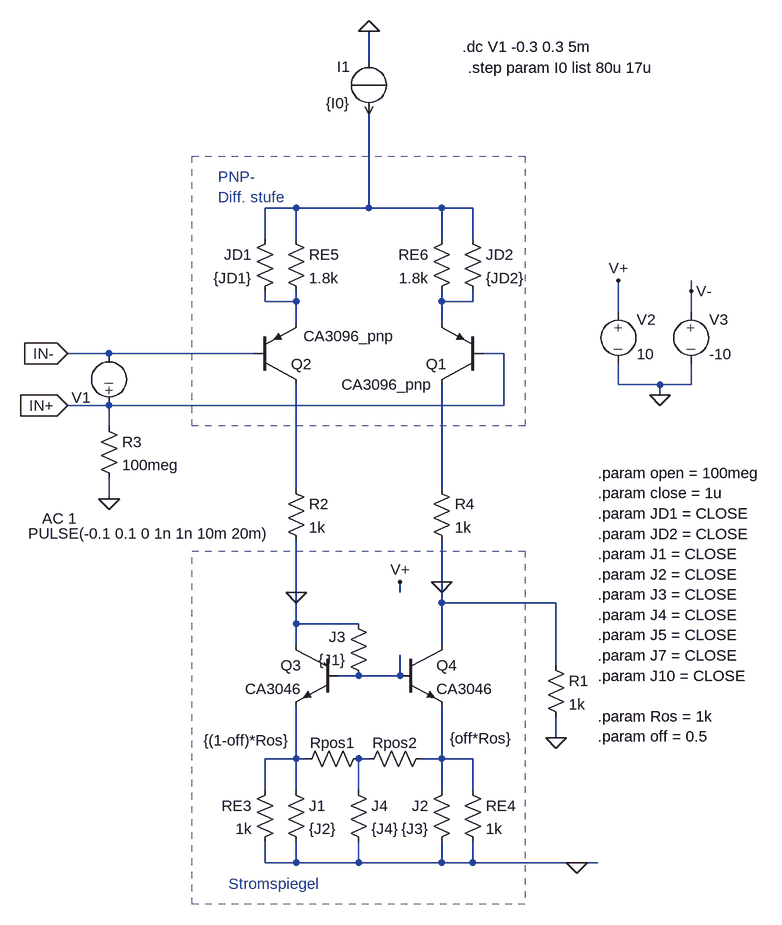
[diagram p0: schematic 2.7.1.4.asc]
2.7.1.4.asc, the LTspice schematic file:
Version 4
SHEET 1 940 1012
WIRE 304 -288 304 -336
WIRE 192 -64 144 -64
WIRE 304 -64 304 -208
WIRE 304 -64 192 -64
WIRE 416 -64 304 -64
WIRE 464 -64 416 -64
WIRE 144 -16 144 -64
WIRE 192 -16 192 -64
WIRE 416 -16 416 -64
WIRE 464 -16 464 -64
WIRE 800 64 800 48
WIRE 144 80 144 64
WIRE 192 80 192 64
WIRE 192 80 144 80
WIRE 416 80 416 64
WIRE 464 80 464 64
WIRE 464 80 416 80
WIRE 688 96 688 48
WIRE 800 96 800 64
WIRE 192 112 192 80
WIRE 416 112 416 80
WIRE -96 160 -160 160
WIRE 128 160 -96 160
WIRE 512 160 480 160
WIRE 688 208 688 176
WIRE 752 208 688 208
WIRE 800 208 800 176
WIRE 800 208 752 208
WIRE 752 224 752 208
WIRE -96 240 -160 240
WIRE 512 240 512 160
WIRE 512 240 -96 240
WIRE -96 272 -96 240
WIRE 192 368 192 208
WIRE 416 368 416 208
WIRE -96 384 -96 352
WIRE 416 512 416 448
WIRE 192 528 192 448
WIRE 352 528 352 512
WIRE 416 544 416 512
WIRE 592 544 416 544
WIRE 192 576 192 528
WIRE 288 576 192 576
WIRE 192 608 192 576
WIRE 416 608 416 544
WIRE 592 640 592 544
WIRE 288 656 256 656
WIRE 352 656 352 624
WIRE 352 656 288 656
WIRE 592 752 592 720
WIRE 192 784 192 704
WIRE 192 784 144 784
WIRE 208 784 192 784
WIRE 304 784 288 784
WIRE 416 784 416 704
WIRE 416 784 384 784
WIRE 464 784 416 784
WIRE 144 832 144 784
WIRE 192 832 192 784
WIRE 288 832 288 784
WIRE 416 832 416 784
WIRE 464 832 464 784
WIRE 144 944 144 912
WIRE 192 944 192 912
WIRE 192 944 144 944
WIRE 288 944 288 912
WIRE 288 944 192 944
WIRE 416 944 416 912
WIRE 416 944 288 944
WIRE 464 944 464 912
WIRE 464 944 416 944
WIRE 624 944 464 944
WIRE 656 944 624 944
FLAG -160 240 IN+
IOPIN -160 240 In
FLAG -160 160 IN-
IOPIN -160 160 In
FLAG -96 384 0
FLAG 752 224 0
FLAG 688 48 V+
FLAG 800 64 V-
FLAG 352 512 V+
FLAG 624 944 0
FLAG 304 -336 0
FLAG 592 752 0
FLAG 192 528 0
FLAG 416 512 0
SYMBOL EIT_Semiconductors\\pnp 480 208 R180
WINDOW 3 77 0 Left 0
SYMATTR Value CA3096_pnp
SYMATTR InstName Q1
SYMBOL EIT_Semiconductors\\pnp 128 208 M180
WINDOW 3 75 75 Left 0
SYMATTR Value CA3096_pnp
SYMATTR InstName Q2
SYMBOL source-V -96 256 R180
WINDOW 123 50 -158 Left 0
WINDOW 39 0 0 Left 0
WINDOW 3 -248 -181 Left 0
SYMATTR Value2 AC 1
SYMATTR InstName V1
SYMATTR Value PULSE(-0.1 0.1 0 1n 1n 10m 20m)
SYMBOL source-I 304 -208 R180
WINDOW 0 29 73 Left 0
WINDOW 3 29 17 Left 0
WINDOW 123 0 0 Left 0
WINDOW 39 0 0 Left 0
SYMATTR InstName I1
SYMATTR Value {I0}
SYMBOL res -112 256 R0
SYMATTR InstName R3
SYMATTR Value 100meg
SYMBOL EIT_Semiconductors\\npn 256 608 M0
SYMATTR InstName Q3
SYMATTR Value CA3046
SYMBOL EIT_Semiconductors\\npn 352 608 R0
SYMATTR InstName Q4
SYMATTR Value CA3046
SYMBOL res 304 768 R90
WINDOW 0 7 56 VBottom 0
WINDOW 3 -28 188 VTop 0
SYMATTR InstName Rpos1
SYMATTR Value {(1-off)*Ros}
SYMBOL res 176 816 R0
SYMATTR InstName J1
SYMATTR Value {J2}
SYMBOL res 432 816 M0
SYMATTR InstName J2
SYMATTR Value {J3}
SYMBOL res 160 816 M0
SYMATTR InstName RE3
SYMATTR Value 1k
SYMBOL res 448 816 R0
SYMATTR InstName RE4
SYMATTR Value 1k
SYMBOL res 304 672 R180
WINDOW 0 36 76 Left 0
WINDOW 3 36 40 Left 0
SYMATTR InstName J3
SYMATTR Value {J1}
SYMBOL res 400 768 R90
WINDOW 0 7 56 VBottom 0
WINDOW 3 -31 -76 VTop 0
SYMATTR InstName Rpos2
SYMATTR Value {off*Ros}
SYMBOL res 272 816 R0
SYMATTR InstName J4
SYMATTR Value {J4}
SYMBOL source-V 688 80 R0
WINDOW 123 0 0 Left 0
WINDOW 39 0 0 Left 0
SYMATTR InstName V2
SYMATTR Value 10
SYMBOL source-V 800 80 R0
WINDOW 123 0 0 Left 0
WINDOW 39 0 0 Left 0
SYMATTR InstName V3
SYMATTR Value -10
SYMBOL res 176 -32 R0
SYMATTR InstName RE5
SYMATTR Value 1.8k
SYMBOL res 432 -32 M0
SYMATTR InstName RE6
SYMATTR Value 1.8k
SYMBOL res 160 -32 M0
SYMATTR InstName JD1
SYMATTR Value {JD1}
SYMBOL res 448 -32 R0
SYMATTR InstName JD2
SYMATTR Value {JD2}
SYMBOL res 576 624 R0
SYMATTR InstName R1
SYMATTR Value 1k
SYMBOL res 176 352 R0
SYMATTR InstName R2
SYMATTR Value 1k
SYMBOL res 400 352 R0
SYMATTR InstName R4
SYMATTR Value 1k
TEXT 72 -112 Left 0 ;PNP-\nDiff. stufe
TEXT 448 -312 Left 0 !.dc V1 -0.3 0.3 5m
TEXT 88 976 Left 0 ;Stromspiegel
TEXT 656 344 Left 0 !.param open = 100meg\n.param close = 1u\n.param JD1 = CLOSE\n.param JD2 = CLOSE\n.param J1 = CLOSE\n.param J2 = CLOSE\n.param J3 = CLOSE\n.param J4 = CLOSE\n.param J5 = CLOSE\n.param J7 = CLOSE\n.param J10 = CLOSE\n \n.param Ros = 1k\n.param off = 0.5
TEXT 456 -280 Left 0 !.step param I0 list 80u 17u
RECTANGLE Normal 544 272 32 -144 2
RECTANGLE Normal 544 1008 32 464 2

The netlist it stands for:
* 2.7.1.4.asc
Q1 N005 IN+ N003 0 CA3096_pnp
Q2 N004 IN- N002 0 CA3096_pnp
V1 IN+ IN- PULSE(-0.1 0.1 0 1n 1n 10m 20m) AC 1
I1 0 N001 {I0}
R3 IN+ 0 100meg
Q3 0 N006 N007 0 CA3046
Q4 0 N006 N009 0 CA3046
Rpos1 N008 N007 {(1-off)*Ros}
R§J1 N007 0 {J2}
R§J2 N009 0 {J3}
RE3 N007 0 1k
RE4 N009 0 1k
R§J3 N006 0 {J1}
Rpos2 N009 N008 {off*Ros}
R§J4 N008 0 {J4}
V2 V+ 0 10
V3 V- 0 -10
RE5 N001 N002 1.8k
RE6 N001 N003 1.8k
R§JD1 N001 N002 {JD1}
R§JD2 N001 N003 {JD2}
R1 0 0 1k
R2 N004 0 1k
R4 N005 0 1k
.model NPN NPN
.model PNP PNP
.lib standard.bjt
* PNP-
* Diff. stufe
.dc V1 -0.3 0.3 5m
* Stromspiegel
.param open = 100meg
.param close = 1u
.param JD1 = CLOSE
.param JD2 = CLOSE
.param J1 = CLOSE
.param J2 = CLOSE
.param J3 = CLOSE
.param J4 = CLOSE
.param J5 = CLOSE
.param J7 = CLOSE
.param J10 = CLOSE
.param Ros = 1k
.param off = 0.5
.step param I0 list 80u 17u
.backanno
.end